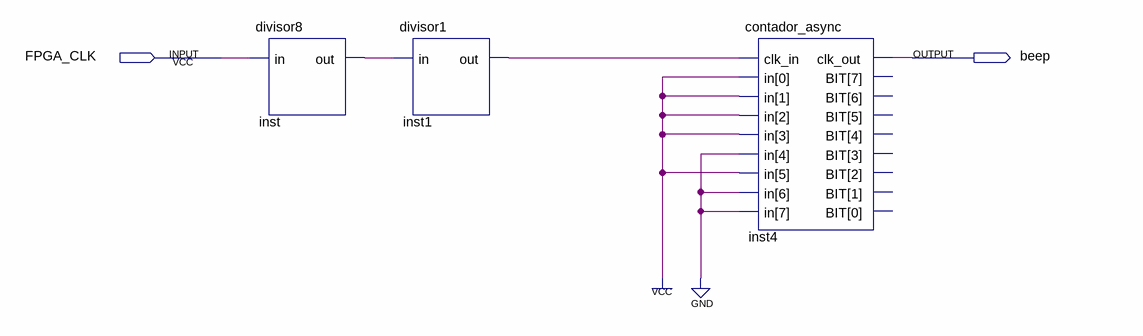
[diagram p0: schematic sheet]
// Quartus schematic buzzer_1046hz.bdf as structural Verilog: 3 symbols, 2 pins
module buzzer_1046hz (
  input  FPGA_CLK,
  output beep
);

  wire inst1_out, inst_out;

  divisor8 inst (.in(FPGA_CLK), .out(inst_out));
  divisor1 inst1 (.in(inst_out), .out(inst1_out));
  contador_async inst4 (.clk_in(inst1_out), .in(8'b00101111), .clk_out(beep));  // open: BIT
endmodule
